# Altium schematic sheet Sheet1.SchDoc
size A4
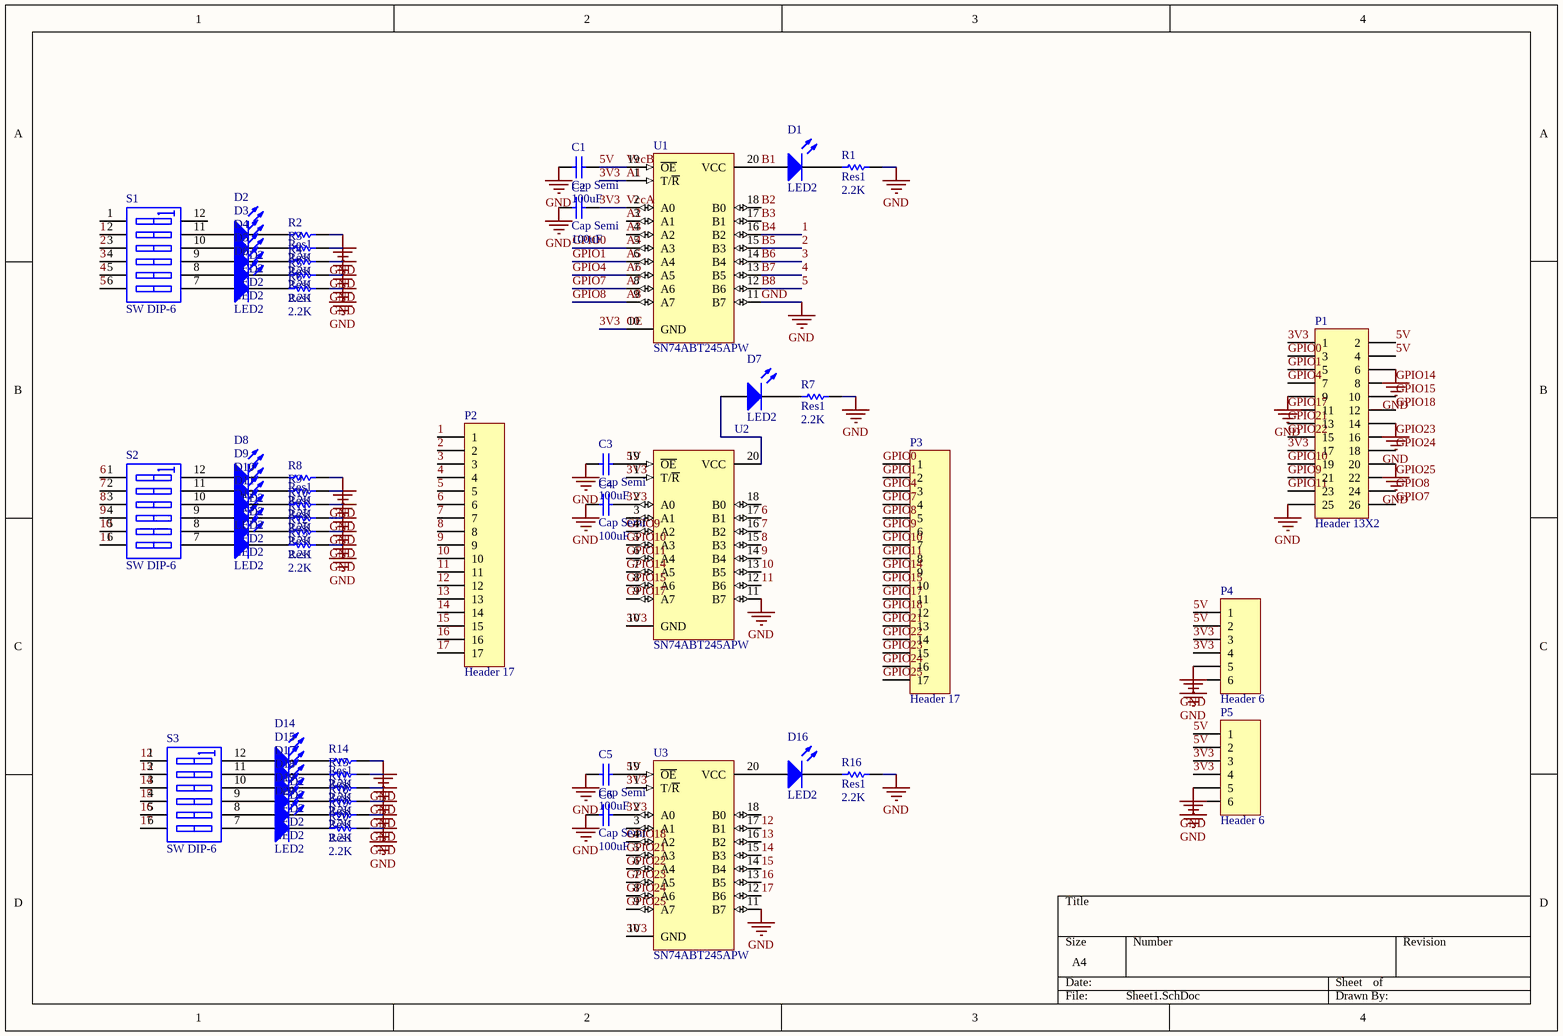
[diagram p0: Sheet1.SchDoc]

## Parts
C1  Cap Semi  value 100uF  [C1206]
C2  Cap Semi  value 100uF  [C1206]
C3  Cap Semi  value 100uF  [C1206]
C4  Cap Semi  value 100uF  [C1206]
C5  Cap Semi  value 100uF  [C1206]
C6  Cap Semi  value 100uF  [C1206]
D1  LED2  [0603]
D2  LED2  [0603]
D3  LED2  [0603]
D4  LED2  [0603]
D5  LED2  [0603]
D6  LED2  [0603]
D7  LED2  [0603]
D8  LED2  [0603]
D9  LED2  [0603]
D10  LED2  [0603]
D11  LED2  [0603]
D12  LED2  [0603]
D13  LED2  [0603]
D14  LED2  [0603]
D15  LED2  [0603]
D16  LED2  [0603]
D17  LED2  [0603]
D18  LED2  [0603]
D19  LED2  [0603]
D20  LED2  [0603]
P1  Header 13X2  [HDR2X13]
P2  Header 17  [HDR1X17]
P3  Header 17  [HDR1X17]
P4  Header 6  [HDR1X6]
P5  Header 6  [HDR1X6]
R1  Res1  value 2.2K  [0603]
R2  Res1  value 2.2K  [0603]
R3  Res1  value 2.2K  [0603]
R4  Res1  value 2.2K  [0603]
R5  Res1  value 2.2K  [0603]
R6  Res1  value 2.2K  [0603]
R7  Res1  value 2.2K  [0603]
R8  Res1  value 2.2K  [0603]
R9  Res1  value 2.2K  [0603]
R10  Res1  value 2.2K  [0603]
R11  Res1  value 2.2K  [0603]
R12  Res1  value 2.2K  [0603]
R13  Res1  value 2.2K  [0603]
R14  Res1  value 2.2K  [0603]
R15  Res1  value 2.2K  [0603]
R16  Res1  value 2.2K  [0603]
R17  Res1  value 2.2K  [0603]
R18  Res1  value 2.2K  [0603]
R19  Res1  value 2.2K  [0603]
R20  Res1  value 2.2K  [0603]
S1  SW DIP-6  [DIP-12/SW]
S2  SW DIP-6  [DIP-12/SW]
S3  SW DIP-6  [DIP-12/SW]
U1  SN74ABT245APW  [PW020]
U2  SN74ABT245APW  [PW020]
U3  SN74ABT245APW  [PW020]

## Nets
GND: C1.1 C2.1 C3.1 C4.1 C5.1 C6.1 P1.6 P1.9 P1.14 P1.20 P1.25 P4.5 P4.6 P5.5 P5.6 R1.2 R2.2 R3.2 R4.2 R5.2 R6.2 R7.2 R8.2 R9.2 R10.2 R11.2 R12.2 R13.2 R14.2 R15.2 R16.2 R17.2 R18.2 R19.2 R20.2 U1.11(B7) U2.11(B7) U3.11(B7)
1: P2.1 S1.2(A2) U1.16(B2)  [also labelled B4]
2: P2.2 S1.3(A3) U1.15(B3)  [also labelled B5]
3: P2.3 S1.4(A4) U1.14(B4)  [also labelled B6]
3V3: C2.2 C4.2 C6.2 P1.1 P1.17 P4.3 P4.4 P5.3 P5.4 U1.1(T/~{R}) U1.2(A0) U1.10(GND) U2.1(T/~{R}) U2.2(A0) U2.10(GND) U3.1(T/~{R}) U3.2(A0) U3.10(GND)  [also labelled A1, OE, VccA]
4: P2.4 S1.5(A5) U1.13(B5)  [also labelled B7]
5: P2.5 S1.6(A6) U1.12(B6)  [also labelled B8]
5V: C1.2 C3.2 C5.2 P1.2 P1.4 P4.1 P4.2 P5.1 P5.2 U1.19(~{OE}) U2.19(~{OE}) U3.19(~{OE})  [also labelled VccB]
6: P2.6 S2.1(A1) U2.17(B1)
7: P2.7 S2.2(A2) U2.16(B2)
8: P2.8 S2.3(A3) U2.15(B3)
9: P2.9 S2.4(A4) U2.14(B4)
10: P2.10 S2.5(A5) U2.13(B5)
11: P2.11 S2.6(A6) U2.12(B6)
12: P2.12 S3.1(A1) U3.17(B1)
13: P2.13 S3.2(A2) U3.16(B2)
14: P2.14 S3.3(A3) U3.15(B3)
15: P2.15 S3.4(A4) U3.14(B4)
16: P2.16 S3.5(A5) U3.13(B5)
17: P2.17 S3.6(A6) U3.12(B6)
A2: U1.3(A1)
A3: U1.4(A2)
A4: P1.3 P3.1 U1.5(A3)  [also labelled GPIO0]
A5: P1.5 P3.2 U1.6(A4)  [also labelled GPIO1]
A6: P1.7 P3.3 U1.7(A5)  [also labelled GPIO4]
A7: P1.26 P3.4 U1.8(A6)  [also labelled GPIO7]
A8: P1.24 P3.5 U1.9(A7)  [also labelled GPIO8]
B1: D1.1(A) U1.20(VCC)
B2: U1.18(B0)
B3: U1.17(B1)
GPIO9: P1.21 P3.6 U2.4(A2)
GPIO10: P1.19 P3.7 U2.5(A3)
GPIO11: P1.23 P3.8 U2.6(A4)
GPIO14: P1.8 P3.9 U2.7(A5)
GPIO15: P1.10 P3.10 U2.8(A6)
GPIO17: P1.11 P3.11 U2.9(A7)
GPIO18: P1.12 P3.12 U3.4(A2)
GPIO21: P1.13 P3.13 U3.5(A3)
GPIO22: P1.15 P3.14 U3.6(A4)
GPIO23: P1.16 P3.15 U3.7(A5)
GPIO24: P1.18 P3.16 U3.8(A6)
GPIO25: P1.22 P3.17 U3.9(A7)
NetD1_2: D1.2(K) R1.1
NetD2_1: D2.1(A) S1.11(B2)
NetD2_2: D2.2(K) R2.1
NetD3_1: D3.1(A) S1.10(B3)
NetD3_2: D3.2(K) R3.1
NetD4_1: D4.1(A) S1.9(B4)
NetD4_2: D4.2(K) R4.1
NetD5_1: D5.1(A) S1.8(B5)
NetD5_2: D5.2(K) R5.1
NetD6_1: D6.1(A) S1.7(B6)
NetD6_2: D6.2(K) R6.1
NetD7_1: D7.1(A) U2.20(VCC)
NetD7_2: D7.2(K) R7.1
NetD8_1: D8.1(A) S2.12(B1)
NetD8_2: D8.2(K) R8.1
NetD9_1: D9.1(A) S2.11(B2)
NetD9_2: D9.2(K) R9.1
NetD10_1: D10.1(A) S2.10(B3)
NetD10_2: D10.2(K) R10.1
NetD11_1: D11.1(A) S2.9(B4)
NetD11_2: D11.2(K) R11.1
NetD12_1: D12.1(A) S2.8(B5)
NetD12_2: D12.2(K) R12.1
NetD13_1: D13.1(A) S2.7(B6)
NetD13_2: D13.2(K) R13.1
NetD14_1: D14.1(A) S3.12(B1)
NetD14_2: D14.2(K) R14.1
NetD15_1: D15.1(A) S3.11(B2)
NetD15_2: D15.2(K) R15.1
NetD16_1: D16.1(A) U3.20(VCC)
NetD16_2: D16.2(K) R16.1
NetD17_1: D17.1(A) S3.10(B3)
NetD17_2: D17.2(K) R17.1
NetD18_1: D18.1(A) S3.9(B4)
NetD18_2: D18.2(K) R18.1
NetD19_1: D19.1(A) S3.8(B5)
NetD19_2: D19.2(K) R19.1
NetD20_1: D20.1(A) S3.7(B6)
NetD20_2: D20.2(K) R20.1

Not connected (* = marked no-connect by the designer): S1 1(A1) 12(B1); U2 3(A1) 18(B0); U3 3(A1) 18(B0)

## Library data of the parts
C1-C6 = Cap Semi: Capacitor (Semiconductor SIM Model); Published: 8-Jun-2000; LatestRevisionDate: 29-May-2009; LatestRevisionNote: IPC-7351 Footprint Added.; PackageReference: C1206; Publisher: Altium Limited; PackageDescription: Chip Capacitor
D1-D20 = LED2: Typical RED, GREEN, YELLOW, AMBER GaAs LED; Published: 8-Jun-2000; LatestRevisionDate: 17-Jul-2002; LatestRevisionNote: Re-released for DXP Platform.; PackageVersion: Feb-2002; PackageReference: 3.2X1.6X1.1; Publisher: Altium Limited; PackageDescription: SM LED; 2 Flat Leads
P1 = Header 13X2: Header, 13-Pin, Dual row; LatestRevisionDate: 17-Jul-2002; LatestRevisionNote: Re-released for DXP Platform.; Publisher: Altium Limited
P2 P3 = Header 17: Header, 17-Pin; LatestRevisionDate: 17-Jul-2002; LatestRevisionNote: Re-released for DXP Platform.; Publisher: Altium Limited
P4 P5 = Header 6: Header, 6-Pin; LatestRevisionDate: 17-Jul-2002; LatestRevisionNote: Re-released for DXP Platform.; Publisher: Altium Limited
R1-R20 = Res1: Resistor; Published: 8-Jun-2000; LatestRevisionDate: 17-Jul-2002; LatestRevisionNote: Re-released for DXP Platform.; PackageReference: AXIAL-0.3; Publisher: Altium Limited; PackageDescription: Axial Device, Thru-Hole; 2 Leads; 0.3 in Pin Spacing
S1-S3 = SW DIP-6: DIP Switch, 6 Position, SPST; Published: 24-Mar-1999; LatestRevisionDate: 17-Jul-2002; LatestRevisionNote: Re-released for DXP Platform.; PackageReference: DIP-12/SW; Publisher: Altium Limited; PackageDescription: DIP Switch; 12 Leads
U1-U3 = SN74ABT245APW: Octal Bus Transceiver with 3-State Outputs; ComponentAvailability: Obsolete; Published: 8-Jun-2000; LatestRevisionDate: 04-Mar-2005; LatestRevisionNote: Stylized 3D Model Added.; DatasheetVersion: Jul-1994; PackageVersion: Feb-1999; PackageReference: PW020; Publisher: Altium Limited; PackageDescription: Shrink Small Outline; 20 Leads; Body Width 4.4 mm; Pitch 0.65 mm; ComponentLink1Description: Manufacturer Link; ComponentLink1URL: http://www.ti.com/; ComponentLink2Description: URL Link1; ComponentLink2URL: http://focus.ti.com/docs/prod/folders/print/sn74abt245a.html